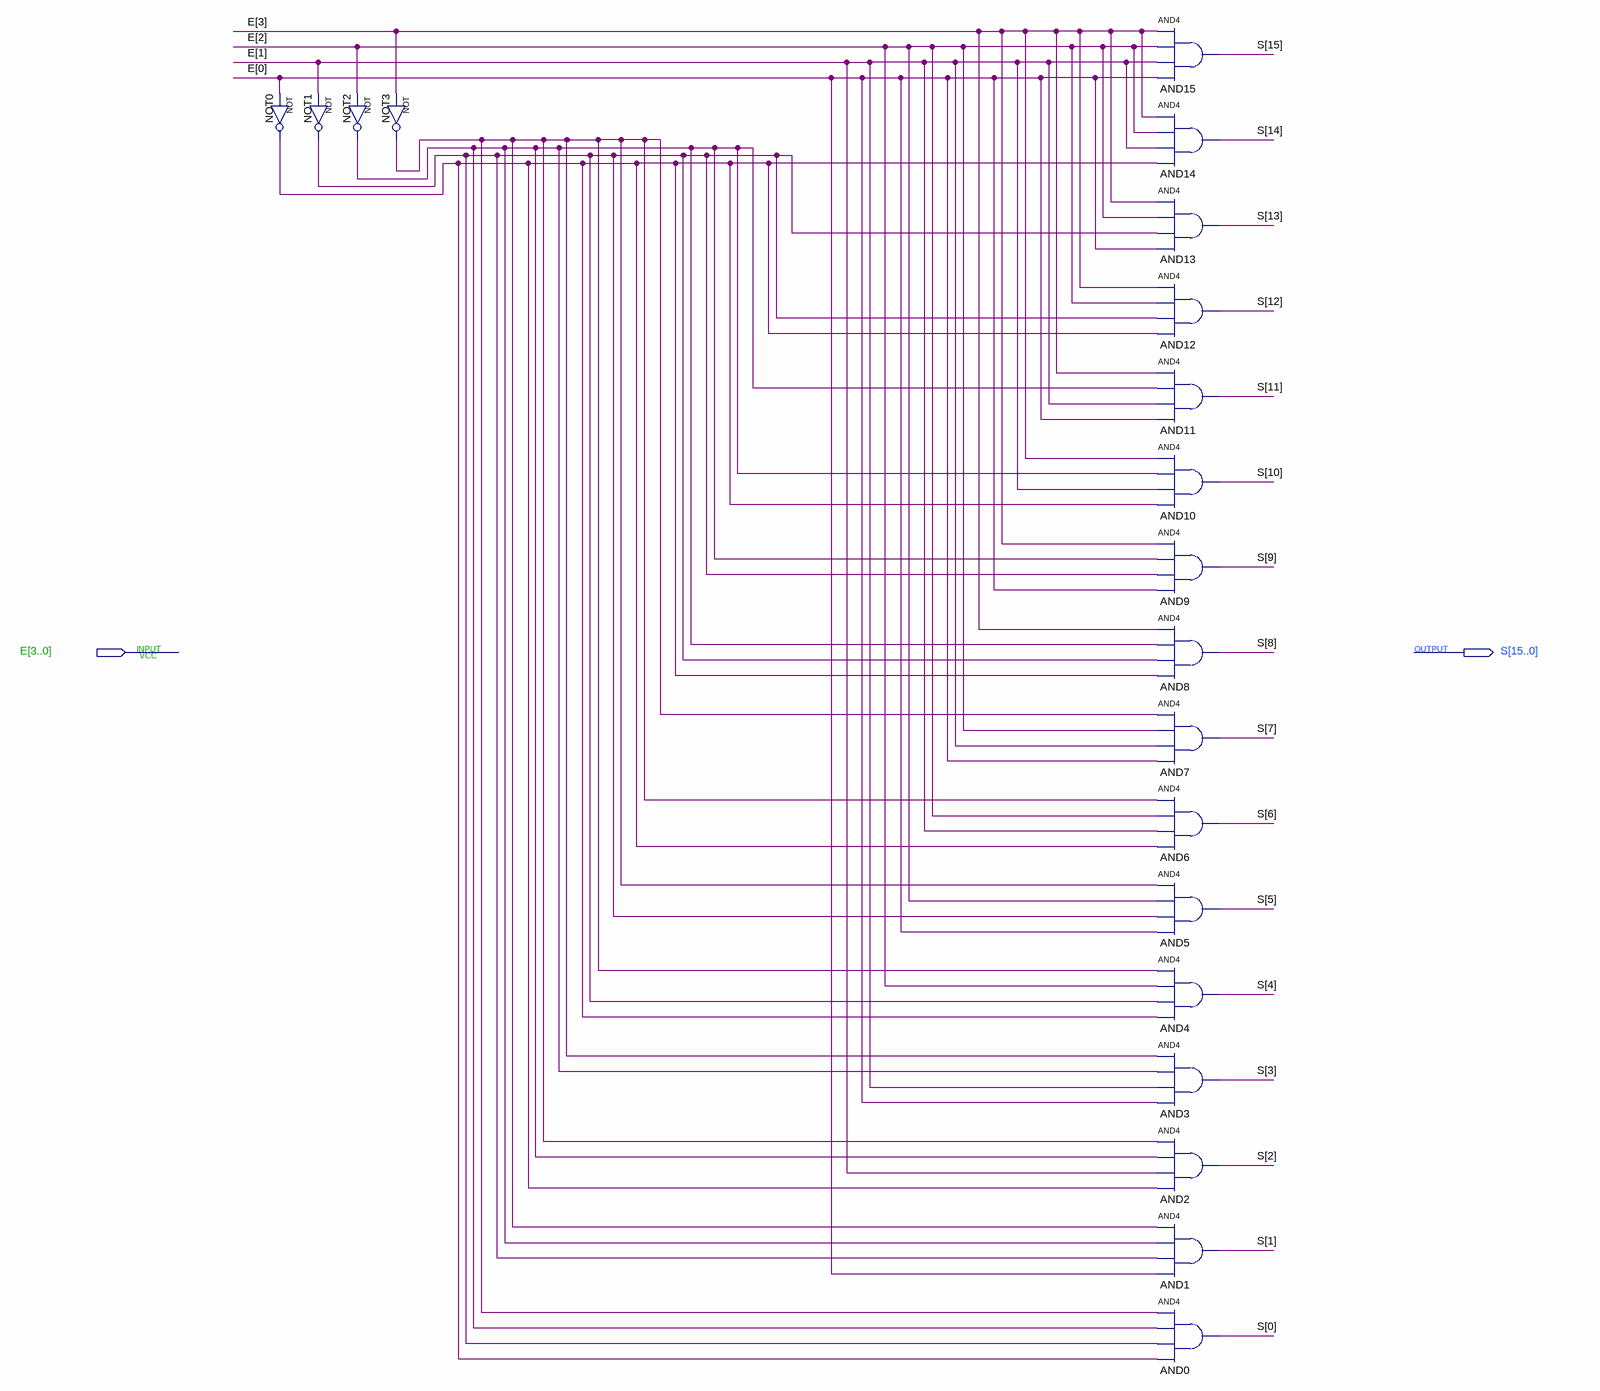
[diagram p0: schematic sheet]
// Quartus schematic DECOD_4_16.bdf as structural Verilog: 20 symbols, 2 pins
module DECOD_4_16 (
  input  [3:0] E,
  output [15:0] S
);

  wire NOT0_out, NOT1_out, NOT2_out, NOT3_out;

  not NOT0 (NOT0_out, E[0]);
  not NOT1 (NOT1_out, E[1]);
  not NOT2 (NOT2_out, E[2]);
  not NOT3 (NOT3_out, E[3]);
  and AND15 (S[15], E[3], E[2], E[1], E[0]);
  and AND14 (S[14], E[3], E[2], E[1], NOT0_out);
  and AND13 (S[13], E[3], E[2], NOT1_out, E[0]);
  and AND12 (S[12], E[3], E[2], NOT1_out, NOT0_out);
  and AND11 (S[11], E[3], NOT2_out, E[1], E[0]);
  and AND10 (S[10], E[3], NOT2_out, E[1], NOT0_out);
  and AND9 (S[9], E[3], NOT2_out, NOT1_out, E[0]);
  and AND8 (S[8], E[3], NOT2_out, NOT1_out, NOT0_out);
  and AND7 (S[7], NOT3_out, E[2], E[1], E[0]);
  and AND6 (S[6], NOT3_out, E[2], E[1], NOT0_out);
  and AND5 (S[5], NOT3_out, E[2], NOT1_out, E[0]);
  and AND4 (S[4], NOT3_out, E[2], NOT1_out, NOT0_out);
  and AND3 (S[3], NOT3_out, NOT2_out, E[1], E[0]);
  and AND2 (S[2], NOT3_out, NOT2_out, E[1], NOT0_out);
  and AND1 (S[1], NOT3_out, NOT2_out, NOT1_out, E[0]);
  and AND0 (S[0], NOT3_out, NOT2_out, NOT1_out, NOT0_out);
endmodule
